# Altium schematic sheet Sheet_1_2025-09-27.schdoc
size 143 x 87 mm
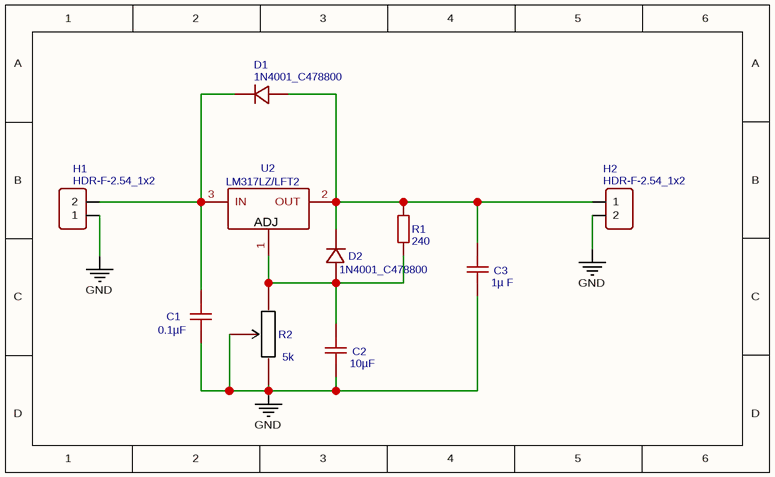
[diagram p0: Sheet_1_2025-09-27.schdoc]

## Parts
C1  0.1µF  [CAPD5.0MMXL2.0MM]
C2  10µF  [CAPD5.0MMXL2.0MM]
C3  1µ F  [CAPD5.0MMXL2.0MM]
D1  1N4001_C478800  [DIODE-1N4001]
D2  1N4001_C478800  [DIODE-1N4001]
H1  HDR-F-2.54_1x2  [2PIN-TERMINALBLOCK-5MM]
H2  HDR-F-2.54_1x2  [2PIN-TERMINALBLOCK-5MM]
R1  240  [R_AXIAL-0.4]
R2  5k  [POTTYPOTPOT]
U2  LM317LZ/LFT2  [PG-TO220-3_L10.0-W4.4-P2.54-L]

## Nets
GND: C1.1 C2.1 C3.1 H1.1 H2.2 R2.2 R2.3
NetC1_2: C1.2 D1.C H1.2 U2.3(IN)
NetC2_2: C2.2 D2.A R1.1 R2.1 U2.1(ADJ)
NetC3_2: C3.2 D1.A D2.C H2.1 R1.2 U2.2(OUT)

## Library data of the parts
C1 = 0.1µF: Manufacturer: ReliaPro; Manufacturer Part: 472M 1KV; Value: 4.7nF; Supplier Part: C15535; Supplier: LCSC; JLCPCB Part Class: Extended Part; spicePre: C; spiceSymbolName: 472M 1KV
C2 = 10µF: Manufacturer: ReliaPro; Manufacturer Part: 472M 1KV; Value: 4.7nF; Supplier Part: C15535; Supplier: LCSC; JLCPCB Part Class: Extended Part; spicePre: C; spiceSymbolName: 472M 1KV
C3 = 1µ F: Manufacturer: ReliaPro; Manufacturer Part: 472M 1KV; Value: 4.7nF; Supplier Part: C15535; Supplier: LCSC; JLCPCB Part Class: Extended Part; spicePre: C; spiceSymbolName: 472M 1KV
D1 D2 = 1N4001_C478800: Manufacturer: JF; Manufacturer Part: 1N4001; Contributor: LCSC; Supplier: LCSC; Supplier Part: C478800; JLCPCB Part Class: Extended Part; spicePre: D; spiceSymbolName: 1N4001_C478800
H1 H2 = HDR-F-2.54_1x2: Contributor: LCEDA_Lib; Supplier Part: C49661; Supplier: LCSC; spicePre: H; spiceSymbolName: HDR-F-2.54_1x2
R1 = 240: Manufacturer: Chian Chia Elec; Contributor: LCSC; nameAlias: Resistance (Ohms); Resistance: 180kΩ; Supplier: LCSC; Supplier Part: C155722; Manufacturer Part: -; spicePre: U; spiceSymbolName: RN-1W-180KΩ±2% T
R2 = 5k: Manufacturer Part: Small potenciometer; Contributor: LewisMojica; spicePre: R; spiceSymbolName: Small potenciometer
U2 = LM317LZ/LFT2: Manufacturer: TI(德州仪器); Contributor: lcsc; Supplier: LCSC; Supplier Part: C2877243; Manufacturer Part: LM317LZ/LFT2; link: https://atta.szlcsc.comnull; spicePre: U; spiceSymbolName: LM317LZ/LFT2